# Altium schematic sheet HOST_FPGA_NonIO.SchDoc: Host FPGA Pwr and Programming
size A4; Organization: Altium Limited.
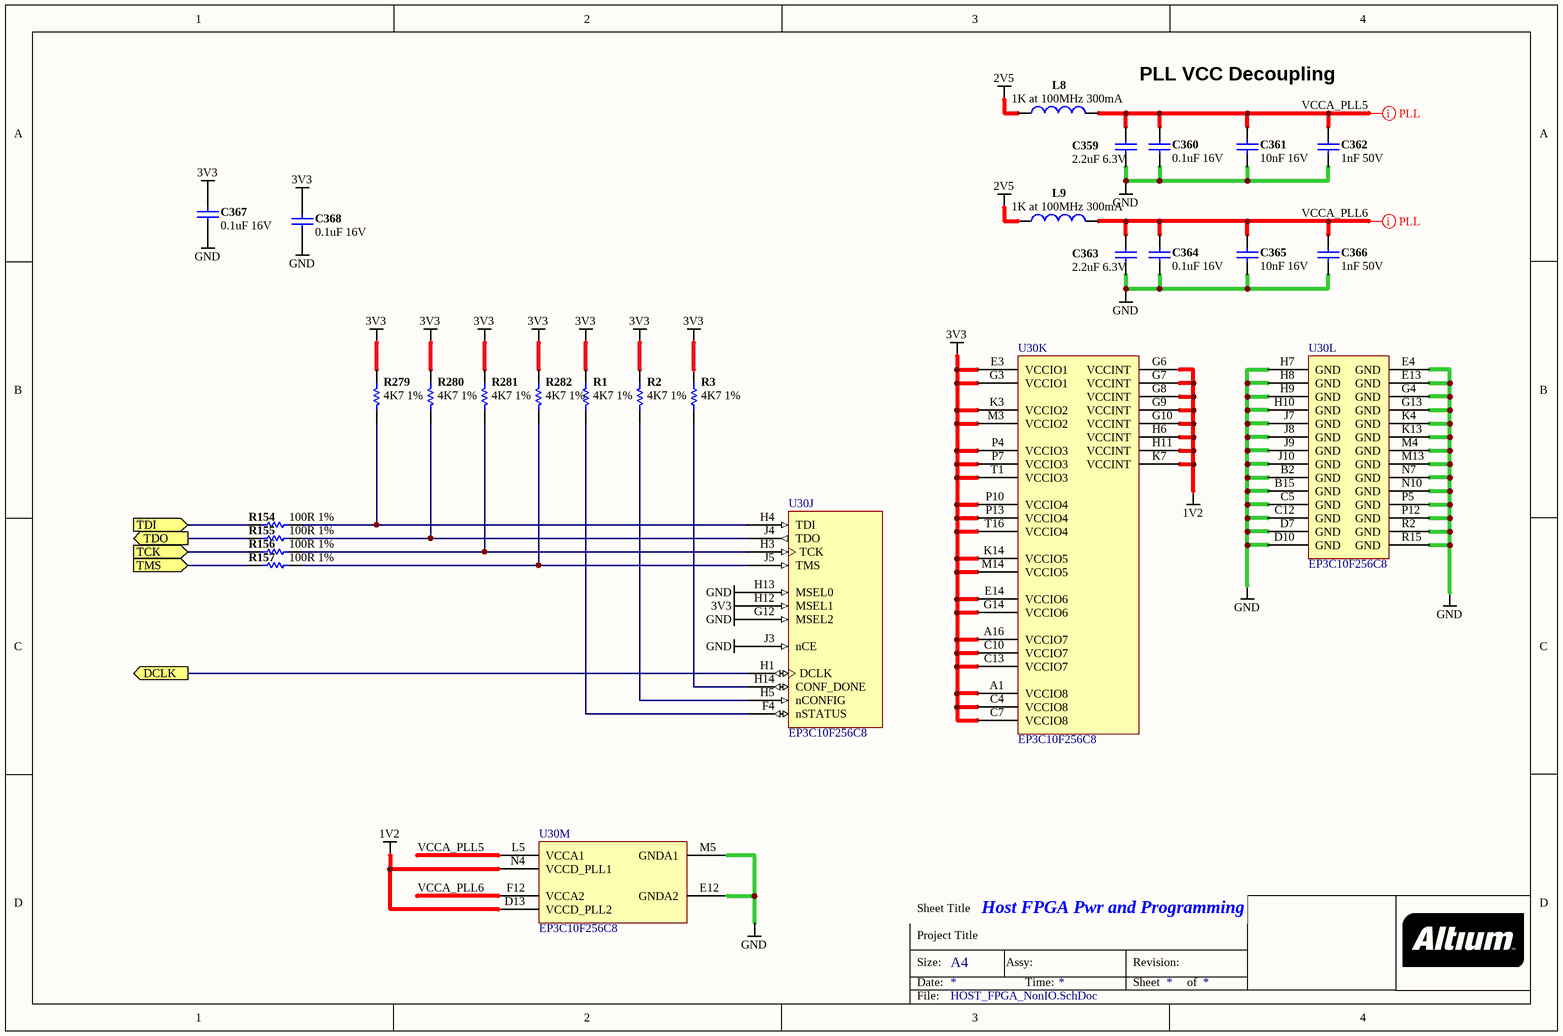
[diagram p0: HOST_FPGA_NonIO.SchDoc]

## Parts
C359  2.2uF 6.3V  [CAPC1005-STAR]
C360  0.1uF 16V  [CAPC1005-STAR]
C361  10nF 16V  [CAPC1005-STAR]
C362  1nF 50V  [CAPC1005-STAR]
C363  2.2uF 6.3V  [CAPC1005-STAR]
C364  0.1uF 16V  [CAPC1005-STAR]
C365  10nF 16V  [CAPC1005-STAR]
C366  1nF 50V  [CAPC1005-STAR]
C367  0.1uF 16V  [CAPC1005-STAR]
C368  0.1uF 16V  [CAPC1005-STAR]
L8  1K at 100MHz 300mA  [INDC1005]
L9  1K at 100MHz 300mA  [INDC1005]
R1  4K7 1%  [RESC1005-STAR]
R2  4K7 1%  [RESC1005-STAR]
R3  4K7 1%  [RESC1005-STAR]
R154  100R 1%  [RESC1005-STAR]
R155  100R 1%  [RESC1005-STAR]
R156  100R 1%  [RESC1005-STAR]
R157  100R 1%  [RESC1005-STAR]
R279  4K7 1%  [RESC1005-STAR]
R280  4K7 1%  [RESC1005-STAR]
R281  4K7 1%  [RESC1005-STAR]
R282  4K7 1%  [RESC1005-STAR]
U30  EP3C10F256C8  [FBGA256-2]  (parts J,K,L,M of 13)

## Ports
DCLK (out), TCK (in), TDI (in), TDO (out), TMS (in)

## Nets
1V2: U30.D13(VCCD_PLL2) U30.G6(VCCINT) U30.G7(VCCINT) U30.G8(VCCINT) U30.G9(VCCINT) U30.G10(VCCINT) U30.H6(VCCINT) U30.H11(VCCINT) U30.K7(VCCINT) U30.N4(VCCD_PLL1)
2V5: L8.1 L9.1
3V3: C367.1 C368.1 R1.1 R2.1 R3.1 R279.1 R280.1 R281.1 R282.1 U30.A1(VCCIO8) U30.A16(VCCIO7) U30.C4(VCCIO8) U30.C7(VCCIO8) U30.C10(VCCIO7) U30.C13(VCCIO7) U30.E3(VCCIO1) U30.E14(VCCIO6) U30.G3(VCCIO1) U30.G14(VCCIO6) U30.H12(MSEL1) U30.K3(VCCIO2) U30.K14(VCCIO5) U30.M3(VCCIO2) U30.M14(VCCIO5) U30.P4(VCCIO3) U30.P7(VCCIO3) U30.P10(VCCIO4) U30.P13(VCCIO4) U30.T1(VCCIO3) U30.T16(VCCIO4)
GND: C359.2 C360.2 C361.2 C362.2 C363.2 C364.2 C365.2 C366.2 C367.2 C368.2 U30.B2(GND) U30.B15(GND) U30.C5(GND) U30.C12(GND) U30.D7(GND) U30.D10(GND) U30.E4(GND) U30.E12(GNDA2) U30.E13(GND) U30.G4(GND) U30.G12(MSEL2) U30.G13(GND) U30.H7(GND) U30.H8(GND) U30.H9(GND) U30.H10(GND) U30.H13(MSEL0) U30.J3(nCE) U30.J7(GND) U30.J8(GND) U30.J9(GND) U30.J10(GND) U30.K4(GND) U30.K13(GND) U30.M4(GND) U30.M5(GNDA1) U30.M13(GND) U30.N7(GND) U30.N10(GND) U30.P5(GND) U30.P12(GND) U30.R2(GND) U30.R15(GND)
DCLK: U30.H1(DCLK) ; port DCLK
TCK: R156.1 ; port TCK
TDI: R154.1 ; port TDI
TDO: R155.1 ; port TDO
TMS: R157.1 ; port TMS
VCCA_PLL5: C359.1 C360.1 C361.1 C362.1 L8.2 U30.L5(VCCA1)
VCCA_PLL6: C363.1 C364.1 C365.1 C366.1 L9.2 U30.F12(VCCA2)
NetR1_2: R1.2 U30.F4(nSTATUS)
NetR2_2: R2.2 U30.H5(nCONFIG)
NetR3_2: R3.2 U30.H14(CONF_DONE)
NetR154_2: R154.2 R279.2 U30.H4(TDI)
NetR155_2: R155.2 R280.2 U30.J4(TDO)
NetR156_2: R156.2 R281.2 U30.H3(TCK)
NetR157_2: R157.2 R282.2 U30.J5(TMS)

## Layout directives
net class PLL: VCCA_PLL5, VCCA_PLL6

## Notes on the sheet
- PLL VCC Decoupling
- Sheet Title
- Project Title
- Size:
- Date:
- A4
- Assy:
- Time:
- Revision:
- Sheet
- of
- File:

## Library data of the parts
C359 C363 = D-101-0112: Capacitor, Ceramic, 2.2uF 10% 6.3V 0402 (1005) X5R; Polarity: Non-Polarized; Tolerance: 20 %; Capacitance: 2.2 uF; Dielectric: X5R; Mounting Technology: Surface Mount; Rated Voltage: 6.3 V; Status: Unreleased; Technology: None; Category: Capacitor
C360 C364 C367 C368 = D-101-0080: Capacitor, Ceramic, 0.1uF 10% 16V 0402 (1005) X7R; Polarity: Non-Polarized; Capacitance: 0.1 uF; Dielectric: X7R; Mounting Technology: Surface Mount; Rated Voltage: 16 V; Status: Production; Technology: Ceramic; Tolerance: 10 %; Category: Capacitor
C361 C365 = D-101-0077: Capacitor, Ceramic, 10nF 10% 16V 0402 (1005) X7R; Polarity: Non-Polarized; Capacitance: 10 nF; Dielectric: X7R; Mounting Technology: Surface Mount; Rated Voltage: 16 V; Status: Production; Technology: Ceramic; Tolerance: 10 %; Category: Capacitor
C362 C366 = D-101-0030: Capacitor, Ceramic, 1nF 10% 50V 0402 (1005) X7R; Polarity: Non-Polarized; Capacitance: 1 nF; Dielectric: X7R; Mounting Technology: Surface Mount; Rated Voltage: 50 V; Status: Production; Technology: Ceramic; Tolerance: 10 %; Category: Capacitor
L8 L9 = D-102-0026: Inductor, Ferrite Bead 1K@100MHz 300mA 0402 BK1005HS102-T; Inductance: nH; Max Input Current: 300 mA; Mounting Technology: Surface Mount; Status: Production; Category: Inductor
R1-R3 R279-R282 = D-100-0088: Resistor, 4K7 1% 0402 (1005); Power Rating: 63 mW; Resistance: 4.7 K; Category: Resistor; Mounting Technology: Surface Mount; Status: Production; Tolerance: 1 %
R154-R157 = D-100-0131: Resistor, 100R 1% 0402 (1005); Power Rating: 63 mW; Mounting Technology: Surface Mount; Resistance: 100 R; Status: Production; Tolerance: 1 %; Category: Resistor
U30 = EP3C10F256C8: Cyclone III Family FPGA, 182 I/O Pins, 4 PLLs, 256-Pin FBGA, Speed Grade 8, Commercial Grade; Published: 26-Feb-2007; DatasheetVersion: ver2.0, May-2008; PackageVersion: ver15.1, May-2008; PackageReference: FBGA256-2; Publisher: Altium Limited; PackageDescription: 256-Ball FineLine Ball Grid Array (FBGA256) - Option 2 - Wire Bond; Code_JEDEC: MO-192-DAF-1; ComponentLink1Description: Manufacturer Link; ComponentLink1URL: http://www.altera.com/; ComponentLink2Description: Handbook (7.86MB); ComponentLink2URL: http://www.altera.com/literature/hb/cyc3/cyclone3_handbook.pdf; ComponentLink3Description: Packaging Specification; ComponentLink3URL: http://www.altera.com/literature/ds/dspkg.pdf